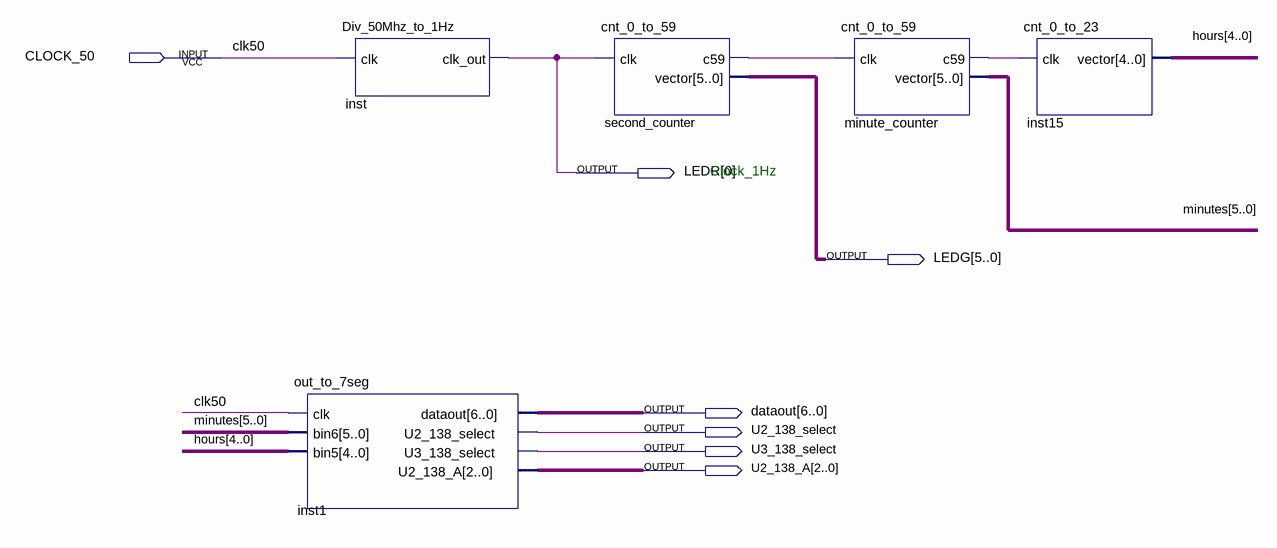
[diagram p0: schematic sheet]
// Quartus schematic MAIN.bdf as structural Verilog: 5 symbols, 7 pins
module MAIN (
  input  CLOCK_50,
  output [0:0] LEDR,
  output [5:0] LEDG,
  output [6:0] dataout,
  output U2_138_select,
  output U3_138_select,
  output [2:0] U2_138_A
);

  wire minute_counter_c59, second_counter_c59;
  wire [4:0] hours;
  wire [5:0] minutes;

  out_to_7seg inst1 (
    .clk(CLOCK_50), .bin6(minutes), .bin5(hours), .dataout(dataout), .U2_138_select(U2_138_select),
    .U3_138_select(U3_138_select), .U2_138_A(U2_138_A));
  Div_50Mhz_to_1Hz inst (.clk(CLOCK_50), .clk_out(LEDR[0]));
  cnt_0_to_59 second_counter (.clk(LEDR[0]), .c59(second_counter_c59), .vector(LEDG));
  cnt_0_to_59 minute_counter (.clk(second_counter_c59), .c59(minute_counter_c59), .vector(minutes));
  cnt_0_to_23 inst15 (.clk(minute_counter_c59), .vector(hours));

  // Other names for the same wires on the sheet: clk50 = CLOCK_50

  // Notes on the sheet:
  //   Clock_1Hz
endmodule
